# EAGLE schematic schematic (EAGLE 9.6.2)
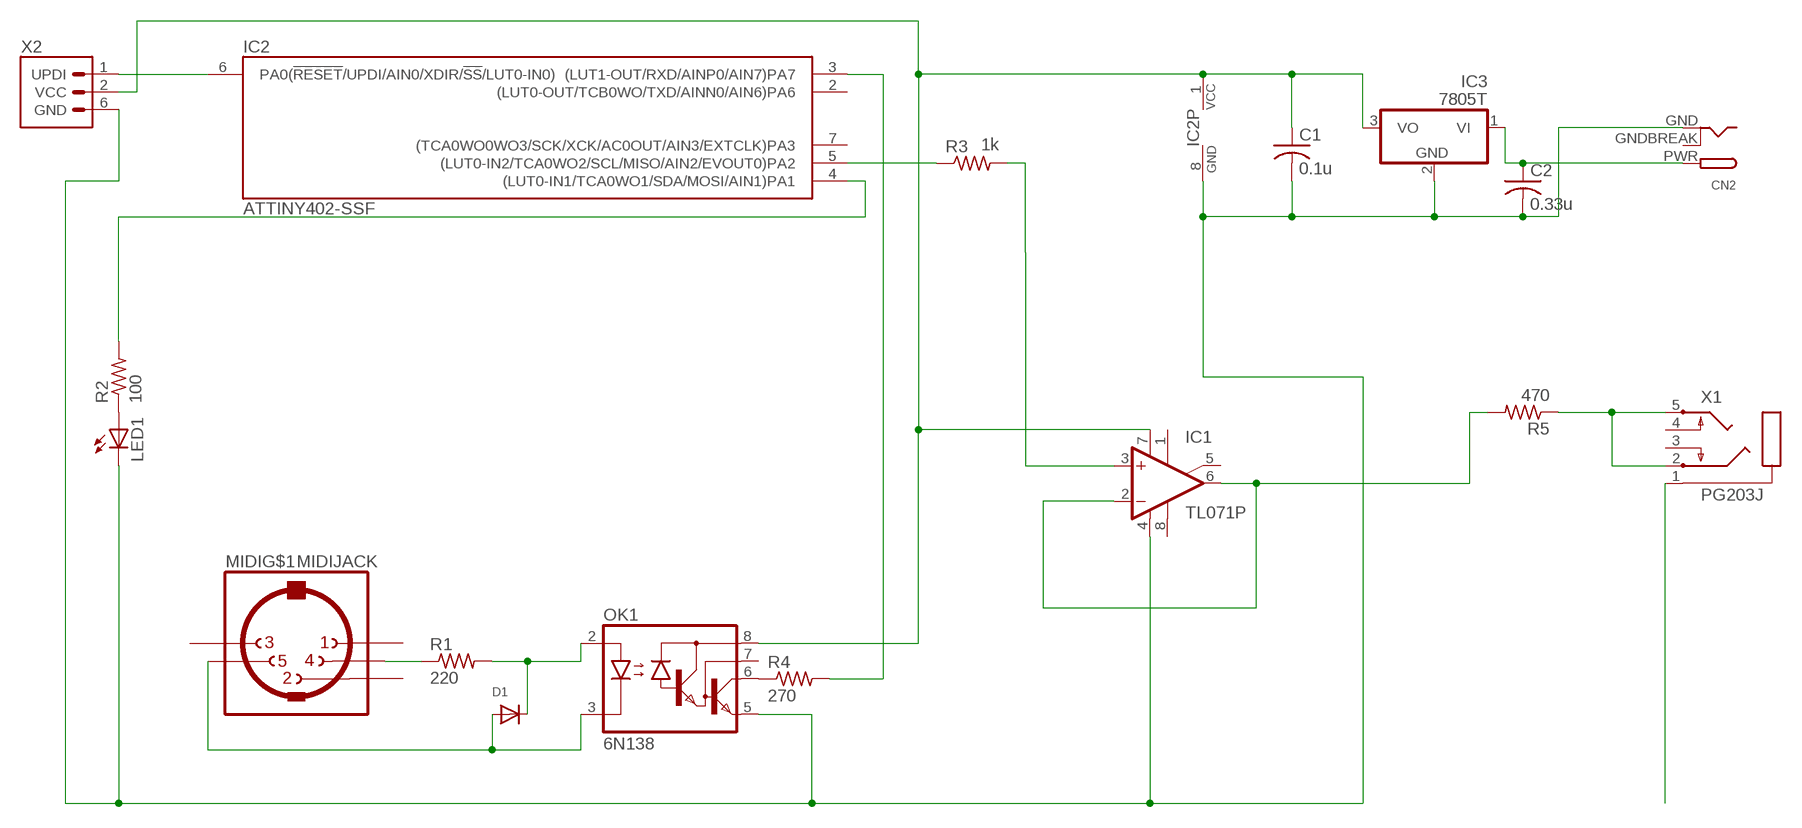
[diagram p0: schematic, sheet 1]

## Parts
C1  0.1u  C-US075-032X103  [C075-032X103]
C2  0.33u  C-US075-032X103  [C075-032X103]
CN2  DCBARRELPTH  [DCJACK_2MM_PTH]
D1  DIODEDO-1N4148  [DO-1N4148]
IC1  TL071P  [DIL08]
IC2  ATTINY402-SSF  [SO8]
IC3  7805T  [TO220H]
LED1  LEDSFH480  [SFH480]
MIDI  MIDIJACK  [CP-2350]
OK1  6N138  [DIL08]
R1  220  R-US_0207/10  [0207/10]
R2  100  R-US_0207/10  [0207/10]
R3  1k  R-US_0207/10  [0207/10]
R4  270  R-US_0207/10  [0207/10]
R5  470  R-US_0207/10  [0207/10]
X1  PG203J  [PG203J]
X2  UPDITHT_100MIL  [PINHEADER_2R03_100MIL]

## Nets
GND: C1.2 C2.2 CN2.GND IC1.4(V-) IC2.8(GND) IC3.2(GND) LED1.K(C) OK1.5(GND) X2.6(GND)
N$1: D1.C OK1.2(A) R1.2
N$2: MIDI.4 R1.1
N$3: D1.A MIDI.5 OK1.3(C)
N$4: LED1.A R2.1
N$5: IC2.6(PA0(!RESET!/UPDI/AIN0/XDIR/!SS!/LUT0-IN0)) X2.1(UPDI)
N$6: OK1.6(VO) R4.1
N$7: IC2.5((LUT0-IN2/TCA0WO2/SCL/MISO/AIN2/EVOUT0)PA2) R3.1
N$8: IC2.3((LUT1-OUT/RXD/AINP0/AIN7)PA7) R4.2
N$9: X1.1
N$10: IC1.3(+IN) R3.2
N$11: IC1.2(-IN) IC1.6(OUT) R5.2
N$12: IC2.4((LUT0-IN1/TCA0WO1/SDA/MOSI/AIN1)PA1) R2.2
N$13: C2.1 CN2.PWR IC3.1(VI)
N$14: R5.1 X1.2 X1.5
VCC: C1.1 IC1.7(V+) IC2.1(VCC) IC3.3(VO) OK1.8(VCC) X2.2(VCC)
Unconnected: IC1.1(ON1) IC1.5(ON2) IC1.8(OPT) IC2.2((LUT0-OUT/TCB0WO/TXD/AINN0/AIN6)PA6) IC2.7((TCA0WO0WO3/SCK/XCK/AC0OUT/AIN3/EXTCLK)PA3) MIDI.1 MIDI.2 MIDI.3 MIDI.PE1(MT) MIDI.PE2(MT) MIDI.PE(MT) MIDI.PE@(MT) OK1.7(VB) X1.3 X1.4

## Power pins joined to a net without a drawn wire
GNDBREAK: CN2.GNDBREAK

## Library data of the parts
C1 C2 = rcl:C-US: CAPACITOR, American symbol; SPICEPREFIX: C
CN2 = adafruit:DCBARREL: 2.0mm DC Barrel Jack DCJACK_2MM_PTH - Through Hole Jack (4UConnector: 05537)
D1 = adafruit:DIODE: Diode SMADIODE - SMA Surface Mount Package 20V 1A Schottky Diode Digikey: 641-1014-6-ND DO-1N4148 - Through Hole Small Current Diode SOD-123 20V 1 A (.5mV Vf) Schottky Diode - Digikey: MBRX120TPMSCT-ND SOD-323 10V 570mA (.38mV Vf, 3ns) Schottky Diode - Digikey: ZLLS410CT-ND SOD-523 30V 30mA Schottky Diode (RB751S-40TE61) - Digikey: RB751S-40TE61CT-ND SOT23-R/W - SOT23 Package (R = Solder Paste/Reflow Ovens, W = Hand-Soldering) BAT54Film 40V 300mA - Digikey: 497-7162-1-ND
IC1 = linear3:TL071: OP AMP
IC2 = atmel:ATTINY*02: 8-bit AVR tiny-0-series Microcontroller CPU: two-cycle hardware multiplier single pin Unified Program Debug Interface (UPDI) programmable watchdog timer with separate on-chip oscillator programmable brown-out detection circuit with software disable function internal calibrated oscillator Status active active ATtiny202 ATtiny402 General purpose working registers 32 SRAM 128 B 256 B Flash 2 kB 4 kB EEPROM 64 B 128 B 16-bit Timer/Counter type A (TCA) 1 16-bit Timer/Counter type B (TCB) 1 Real Time Counter (RTC) 1 USART 1 SPI 1 TWI (I2C) 1 ADC 1 ADC channels 6 ADC resolution 10 bit AC 1 Custom Configurable Logic/Lookup tables 1/2 Window Watchdog 1 Event System channels 3 General purpose I/O 6 External interrupts 6 CRCSCAN 1 Operating voltage 1.8 ... 5.5 V Speed grade 0 ... 5 MHz @ 1.8 ... 5.5 V 0 ... 10 MHz @ 2.7 ... 5.5 V 0 ... 20 MHz @ 4.5 ... 5.5 V Clock options internal 16/20 MHz low power RC oscillator internal 32.768 kHz ultra low power RC oscillator external clock input Pin Name Other/Special ADC0 AC0 USART0 SPI0 TWI0 TCA0 TCB0 CCL PA0 !RESET, UPDI AIN0 XDIR !SS LUT0-IN0 PA1 AIN1 TxD MOSI SDA WO1 LUT0-IN1 PA2 EVOUT0 AIN2 RxD MISO SCL WO2 LUT0-IN2 PA3 EXTCLK AIN3 OUT XCK SCK WO0/WO3 PA6 AIN6 AINN0 TxD MOSI WO LUT0-OUT PA7 AIN7 AINP0 RxD MISO WO0 LUT1-OUT
IC3 = adafruit:78*: Positive VOLTAGE REGULATOR Added bigger pads to the TO-92 package
LED1 = adafruit:LED: LED OSRAM: - CHIPLED LG R971, LG N971, LY N971, LG Q971, LY Q971, LO R971, LY R971 LH N974, LH R974 LS Q976, LO Q976, LY Q976 LO Q996 - Hyper CHIPLED LW Q18S LB Q993, LB Q99A, LB R99A - SideLED LS A670, LO A670, LY A670, LG A670, LP A670 LB A673, LV A673, LT A673, LW A673 LH A674 LY A675 LS A676, LA A676, LO A676, LY A676, LW A676 LS A679, LY A679, LG A679 - Hyper Micro SIDELED® LS Y876, LA Y876, LO Y876, LY Y876 LT Y87S - SmartLED LW L88C, LW L88S LB L89C, LB L89S, LG L890 LS L89K, LO L89K, LY L89K LS L896, LA L896, LO L896, LY L896 - TOPLED LS T670, LO T670, LY T670, LG T670, LP T670 LSG T670, LSP T670, LSY T670, LOP T670, LYG T670 LG T671, LOG T671, LSG T671 LB T673, LV T673, LT T673, LW T673 LH T674 LS T676, LA T676, LO T676, LY T676, LB T676, LH T676, LSB T676, LW T676 LB T67C, LV T67C, LT T67C, LS T67K, LO T67K, LY T67K, LW E67C LS E67B, LA E67B, LO E67B, LY E67B, LB E67C, LV E67C, LT E67C LW T67C LS T679, LY T679, LG T679 LS T770, LO T770, LY T770, LG T770, LP T770 LB T773, LV T773, LT T773, LW T773 LH T774 LS E675, LA E675, LY E675, LS T675 LS T776, LA T776, LO T776, LY T776, LB T776 LHGB T686 LT T68C, LB T68C - Hyper Mini TOPLED® LB M676 - Mini TOPLED Santana® LG M470 LS M47K, LO M47K, LY M47K Source: http://www.osram.convergy.de/
MIDI = adafruit:MIDIJACK: DIN 5 jack also known as MIDI jack A modification of conn-hirshman:MAB5SH with two options for the grounding 'teeth'
OK1 = optocoupler:6N138: MOTOROLA OPTO COUPLER; MF: VISHAY/TELEFUNKEN; MPN: 6N138; OC_FARNELL: 9860150; OC_NEWARK: 35K5294
R1-R5 = adafruit:R-US_: RESISTOR, American symbol
X1 = con-hirschmann:PG203J: MIC/HEADPHONE JACK KS-S stereo microphone/headphone jack PG203JN (Schukat); OC_FARNELL: unknown; OC_NEWARK: unknown
X2 = atmel:UPDI: UPDI Programmer Interface refere to Atmel/Microchip description of pin header style <http://microchipdeveloper.com/atmelice:updi>; OC_FARNELL: unknown; OC_NEWARK: unknown